# EAGLE design connector_board (EAGLE 9.4.2)

## Sheet 1 of 2
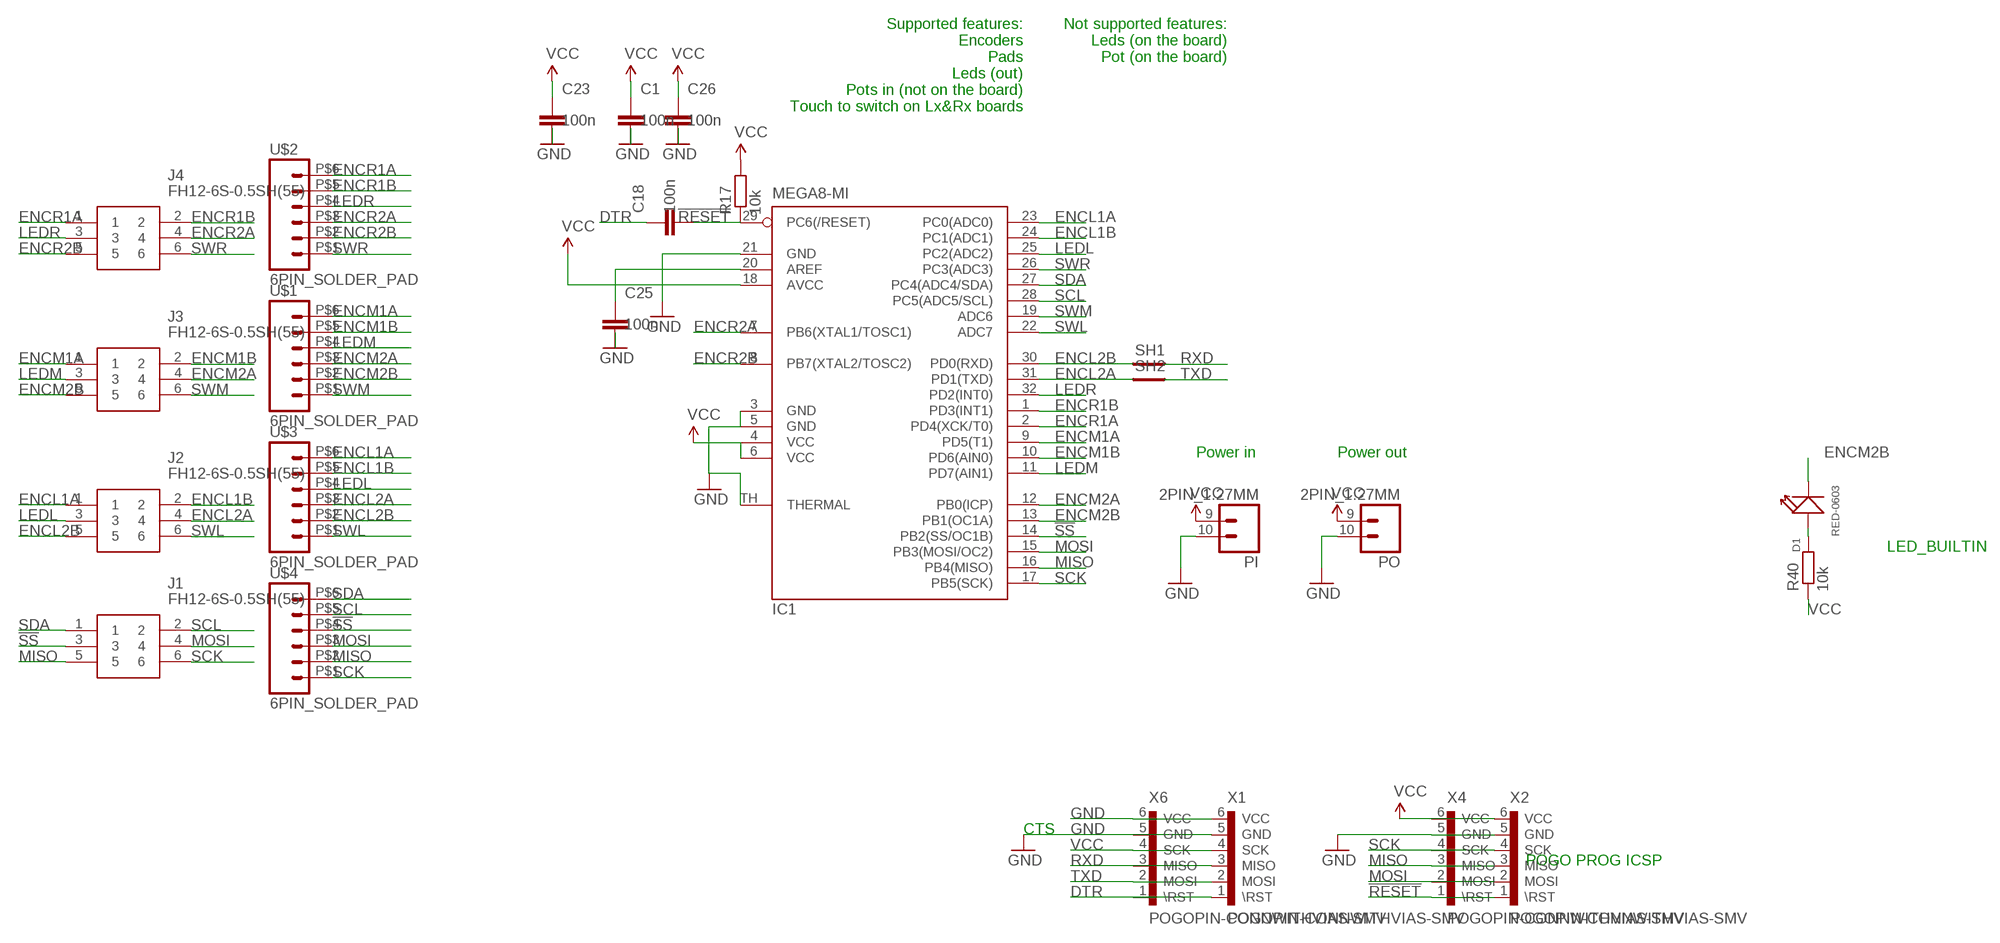
[diagram p0: schematic, sheet 1]

### Parts
C1  100n  C-EUC0603  [C0603]
C18  100n  C-EUC0603  [C0603]
C23  100n  C-EUC0603  [C0603]
C25  100n  C-EUC0603  [C0603]
C26  100n  C-EUC0603  [C0603]
D1  RED-0603  LED-SMD-RED-DIFFUSED(0603)  [LED-0603]
IC1  MEGA8-MI  [MLF32-TH]
J1  FH12-6S-0.5SH(55)  [FH12-6S-0.5SH(55)_1]
J2  FH12-6S-0.5SH(55)  [FH12-6S-0.5SH(55)_1]
J3  FH12-6S-0.5SH(55)  [FH12-6S-0.5SH(55)_1]
J4  FH12-6S-0.5SH(55)  [FH12-6S-0.5SH(55)_1]
PI  2PIN_1.27MM  [1X02_1.27MM_NO_SILK]
PO  2PIN_1.27MM  [1X02_1.27MM_NO_SILK]
R17  10k  R-EU_R0603  [R0603]
R40  10k  R-EU_R0603  [R0603]
SH1  SHORT  [SHORT_TOP_8MIL]
SH2  SHORT  [SHORT_TOP_8MIL]
U$1  6PIN_SOLDER_PAD  [6PIN_SOLDER_PAD]
U$2  6PIN_SOLDER_PAD  [6PIN_SOLDER_PAD]
U$3  6PIN_SOLDER_PAD  [6PIN_SOLDER_PAD]
U$4  6PIN_SOLDER_PAD  [6PIN_SOLDER_PAD]
X1  POGOPIN-CONNWITHVIAS-SMV  [POGOPROG-CONN-OH-SMALLERVIAS]
X2  POGOPIN-CONNWITHVIAS-SMV  [POGOPROG-CONN-OH-SMALLERVIAS]
X4  POGOPIN-CONNWITHVIAS-SMV  [POGOPROG-CONN-OH-SMALLERVIAS]
X6  POGOPIN-CONNWITHVIAS-SMV  [POGOPROG-CONN-OH-SMALLERVIAS]

### Nets
!RESET: C18.2 IC1.29(PC6(/RESET)) R17.1 X2.1(\RST) X4.1(\RST)
!SS: IC1.14(PB2(SS/OC1B)) J1.3 U$4.P$4
AREF: C25.1 IC1.20(AREF)
DTR: C18.1 X1.1(\RST) X6.1(\RST)
ENCL1A: IC1.23(PC0(ADC0)) J2.1 U$3.P$6
ENCL1B: IC1.24(PC1(ADC1)) J2.2 U$3.P$5
ENCL2A: IC1.31(PD1(TXD)) J2.4 SH2.P$1 U$3.P$3
ENCL2B: IC1.30(PD0(RXD)) J2.5 SH1.P$1 U$3.P$2
ENCM1A: IC1.9(PD5(T1)) J3.1 U$1.P$6
ENCM1B: IC1.10(PD6(AIN0)) J3.2 U$1.P$5
ENCM2A: IC1.12(PB0(ICP)) J3.4 U$1.P$3
ENCM2B: D1.- IC1.13(PB1(OC1A)) J3.5 U$1.P$2
ENCR1A: IC1.2(PD4(XCK/T0)) J4.1 U$2.P$6
ENCR1B: IC1.1(PD3(INT1)) J4.2 U$2.P$5
ENCR2A: IC1.7(PB6(XTAL1/TOSC1)) J4.4 U$2.P$3
ENCR2B: IC1.8(PB7(XTAL2/TOSC2)) J4.5 U$2.P$2
GND: C1.2 C23.2 C25.2 C26.2 IC1.3(GND) IC1.5(GND) IC1.21(GND) IC1.TH(THERMAL) PI.10 PO.10 X1.5(GND) X1.6(VCC) X2.5(GND) X4.5(GND) X6.5(GND) X6.6(VCC) ; also sheet 2
LEDL: IC1.25(PC2(ADC2)) J2.3 U$3.P$4
LEDM: IC1.11(PD7(AIN1)) J3.3 U$1.P$4
LEDR: IC1.32(PD2(INT0)) J4.3 U$2.P$4
MISO: IC1.16(PB4(MISO)) J1.5 U$4.P$2 X2.3(MISO) X4.3(MISO) ; also sheet 2
MOSI: IC1.15(PB3(MOSI/OC2)) J1.4 U$4.P$3 X2.2(MOSI) X4.2(MOSI) ; also sheet 2
N$1: D1.+ R40.2
RXD: SH1.P$2 X1.3(MISO) X6.3(MISO)
SCK: IC1.17(PB5(SCK)) J1.6 U$4.P$1 X2.4(SCK) X4.4(SCK) ; also sheet 2
SCL: IC1.28(PC5(ADC5/SCL)) J1.2 U$4.P$5
SDA: IC1.27(PC4(ADC4/SDA)) J1.1 U$4.P$6
SWL: IC1.22(ADC7) J2.6 U$3.P$1
SWM: IC1.19(ADC6) J3.6 U$1.P$1
SWR: IC1.26(PC3(ADC3)) J4.6 U$2.P$1
TXD: SH2.P$2 X1.2(MOSI) X6.2(MOSI)
VCC: C1.1 C23.1 C26.1 IC1.4(VCC) IC1.6(VCC) IC1.18(AVCC) PI.9 PO.9 R17.2 R40.1 X1.4(SCK) X2.6(VCC) X4.6(VCC) X6.4(SCK)

### Notes on the sheet
- Supported features:
  Encoders
  Pads
  Leds (out)
  Pots in (not on the board)
  Touch to switch on Lx&Rx boards
- Not supported features:
  Leds (on the board)
  Pot (on the board)
- Power in | Power out
- LED_BUILTIN
- CTS
- POGO PROG ICSP

## Sheet 2 of 2
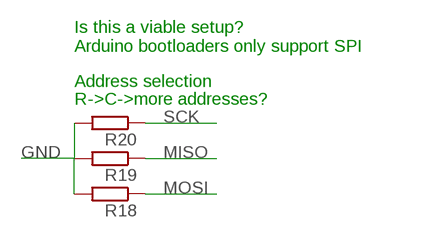
[diagram p1: schematic, sheet 2]

### Parts
R18  R-EU_R0603  [R0603]
R19  R-EU_R0603  [R0603]
R20  R-EU_R0603  [R0603]

### Nets
GND: R18.2 R19.2 R20.2 ; also sheet 1
MISO: R19.1 ; also sheet 1
MOSI: R18.1 ; also sheet 1
SCK: R20.1 ; also sheet 1

### Notes on the sheet
- Is this a viable setup?
  Arduino bootloaders only support SPI
- Address selection
- R->C->more addresses?

## Library data of the parts
C1 C18 C23 C25 C26 = rcl:C-EU: CAPACITOR, European symbol; SPICEPREFIX: C
D1 = Seeed-LED-2016:LED-SMD-RED-DIFFUSED(0603): 304090042; MPN: 19-217-R6C-AL1M2VY-3T
IC1 = atmel:MEGA8-MI: MICROCONTROLLER 8 Kbytes FLASH, 1 kbytes SRAM, 512 bytes EEPROM, USART, 6-channel 10 bit ADC, 2-channel 8 bit ADC Pin compatible with Atmega48, ATMega88, ATMega168 Source: avr.lbr; MPN: ATMEGA88PA-MU; OC_FARNELL: 1715491; OC_NEWARK: 15R0272
J1-J4 = FH12-6S-0.5SH(55):FH12-6S-0.5SH(55): HIROSE(HRS) - FH12-6S-0.5SH(55) - FFC/FPC CONNECTOR, RECEPTACLE, 6POS 1ROW Source: Datasheet <https://www.hirose.com/product/en/download_file/key_name/FH12-6S-0.5SH(55)/category/Drawing (2D)/doc_file_id/75611/?file_category_id=6&item_id=05860582555&is_series=>; DESCRIPTION: HIROSE(HRS) - FH12-6S-0.5SH(55) - FFC/FPC CONNECTOR, RECEPTACLE, 6POS 1ROW; HEIGHT: mm; MANUFACTURER_NAME: Hirose; MANUFACTURER_PART_NUMBER: FH12-6S-0.5SH(55); MOUSER_PART_NUMBER: 798-FH12-6S-0.5SH55; MOUSER_PRICE-STOCK: https://www.mouser.com/Search/Refine.aspx?Keyword=798-FH12-6S-0.5SH55; RS_PART_NUMBER: 7388811P; RS_PRICE-STOCK: http://uk.rs-online.com/web/p/products/7388811P
PI PO = edge:2PIN_1.27MM
R17-R20 R40 = rcl:R-EU_: RESISTOR, European symbol; SPICEPREFIX: R
SH1 SH2 = shorts:SHORT: Short between two nets
U$1-U$4 = edge:6PIN_SOLDER_PAD
X1 X2 X4 X6 = Protofusion:POGOPIN-CONN: Protofusion custom pogo pin programming header

## Board
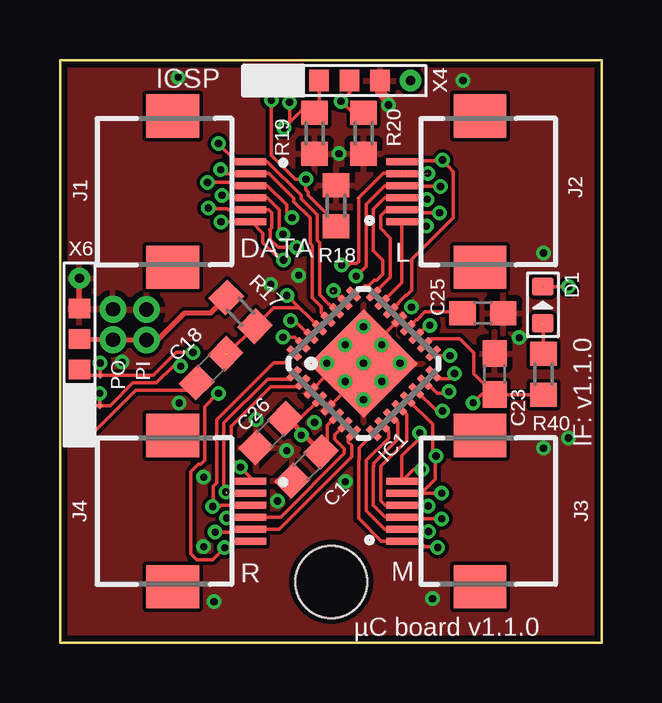
[diagram p2: board, top side]
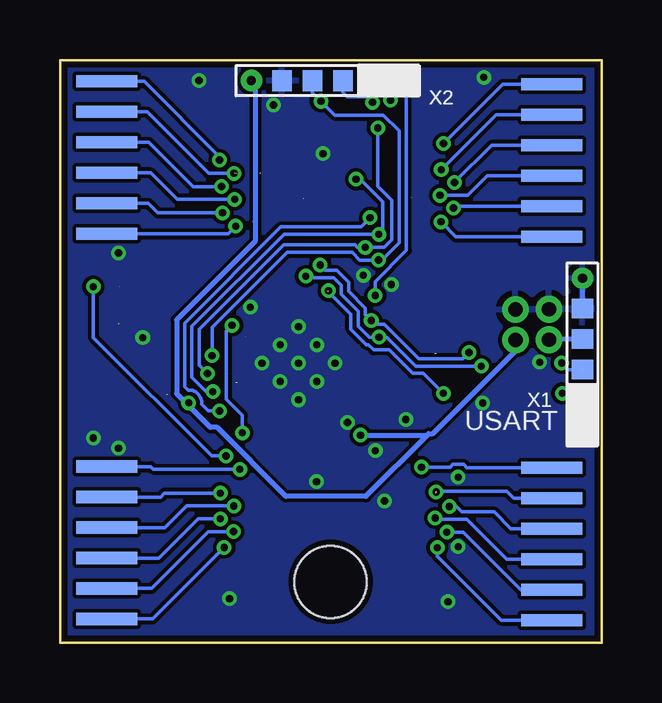
[diagram p3: board, bottom side, seen from below]

Size 22.58 x 24.28 mm. Coordinates in mm from the lower left corner, seen from the top.
Outline: 0,0 0,24.28 22.58,24.28 22.58,0 0,0
Copper layers (1*16): Top 0.035mm / dielectric 1.5mm / Bottom 0.035mm
Design rules "seeed-studio-2-layer *": minimum track width 6mil, minimum drill 0.3mm, track to track 6mil, track to pad 6mil, pad to pad 6mil, via to via 6mil, smd to smd 0mil, copper to edge 10mil, drill to drill 10mil, minimum pad ring 10mil, minimum via ring 6mil, stop-mask expansion 2mil, vias tented up to drill 100mil, thermal gap 10mil
Holes 3 mm at 11.3,2.54

### Footprints (pad centres in the part's own frame; a part is rotated, then mirrored left to right if it is on the bottom)
C0603 = smd 1.1 x 1: 1 -0.85,0; 2 0.85,0
LED-0603 = smd 0.762 x 0.889: + -0.762,0; - 0.762,0
MLF32-TH = smd 0.7 x 0.3: 1 -2.35,1.75; 2 -2.35,1.25; 3 -2.35,0.75; 4 -2.35,0.25; 5 -2.35,-0.25; 6 -2.35,-0.75; 7 -2.35,-1.25; 8 -2.35,-1.75; 17 2.35,-1.75; 18 2.35,-1.25; 19 2.35,-0.75; 20 2.35,-0.25; 21 2.35,0.25; 22 2.35,0.75; 23 2.35,1.25; 24 2.35,1.75 | smd 0.3 x 0.7: 9 -1.75,-2.35; 10 -1.25,-2.35; 11 -0.75,-2.35; 12 -0.25,-2.35; 13 0.25,-2.35; 14 0.75,-2.35; 15 1.25,-2.35; 16 1.75,-2.35; 25 1.75,2.35; 26 1.25,2.35; 27 0.75,2.35; 28 0.25,2.35; 29 -0.25,2.35; 30 -0.75,2.35; 31 -1.25,2.35; 32 -1.75,2.35 | smd 3.2 x 3.2: TH 0,0
FH12-6S-0.5SH(55)_1 = smd 0.3 x 1.3: 1 -1.25,0; 2 -0.75,0; 3 -0.25,0; 4 0.25,0; 5 0.75,0; 6 1.25,0 | smd 1.8 x 2.2: 7 -3.15,-3.25; 8 3.15,-3.25
1X02_1.27MM_NO_SILK = drill 0.6: 9 0,0; 10 1.27,0
R0603 = smd 1 x 1.1: 1 -0.85,0; 2 0.85,0
SHORT_TOP_8MIL = smd 0.203 x 0.203: P$1 0,0; P$2 0,0
6PIN_SOLDER_PAD = smd 0.508 x 2.54: P$1 0,0; P$2 1.27,0; P$3 2.54,0; P$4 3.81,0; P$5 5.08,0; P$6 6.35,0
POGOPROG-CONN-OH-SMALLERVIAS = drill 0.381: 1 0,2.54; 6 0,-3.81 | smd 0.889 x 0.813: 2 0,1.27; 3 0,0; 4 0,-1.27; 5 0,-2.54

### Placement (x,y rotation side)
C1  10.28,7.35 225 top
C18  6.3,11.44 45 top
C23  18.11,11.2 90 top
C25  17.62,13.73 0 top
C26  8.77,8.73 225 top
D1  20.12,14.08 90 top
IC1  12.65,11.64 45 top
J1  7.95,18.8 270 top
J2  14.25,18.8 90 top
J3  14.25,5.49 90 top
J4  7.95,5.49 270 top
PI  3.61,12.61 90 top
PO  2.21,12.63 90 top
R17  7.53,13.79 135 top
R18  11.5,18.21 90 top
R19  10.61,21.23 270 top
R20  12.65,21.23 270 top
R40  20.14,11.19 90 top
SH1  1.68,11.14 45 top
SH2  1.65,9.88 45 top
U$1  20.62,7.34 270 bottom
U$2  2.08,0.94 90 bottom
U$3  20.62,23.39 270 bottom
U$4  2.08,16.92 90 bottom
X1  0.81,11.38 180 bottom
X2  10.79,23.42 270 bottom
X4  10.8,23.43 90 top
X6  0.81,11.38 180 top

### Tracks (layer width: path | path; a pad name or v marks a point on that pad's centre or on a via)
!RESET  (via drill 0.3)  (3 unrouted)
  Top 0.152: IC1.29 10.38,13.55 9.97,13.96 | 9.97,13.96 9.46,14.47 v9.45,14.47 | 9.97,13.96 8.9,13.96 R17.1 6.98,12.04
  Bottom 0.152: X4.1 8.14,23.31 8.14,16.35 9.45,15.05 v9.45,14.47
!SS  (via drill 0.3)
  Top 0.152: IC1.14 15.69,9.66 v15.94,9.66 | v9.66,17.71 9.44,17.94 9.44,18.25 8.64,19.05 J1.3 7.27,19.05 7.13,19.18 v6.14,19.18
  Bottom 0.152: v15.94,9.66 16.25,9.66 16.4,9.66 16.68,9.93 arc-55 16.87,10.41 arc-45 17.16,10.53 17.25,10.53 17.39,10.67 17.39,13.31 13.38,17.32 10.02,17.32 9.66,17.68 v9.66,17.71 | U$4.P$4 4.6,20.73 v6.14,19.18
AREF
  Top 0.152: C25.1 16.72,13.79 15.21,13.79 14.88,13.46 14.83,13.46 IC1.20
DTR  (1 unrouted)
  Top 0.152: X1.1 1.47,8.84 3.15,10.52 5.38,10.52 C18.1 5.7,10.96
ENCL1A  (via drill 0.3)
  Top 0.152: IC1.23 14.25,15 J2.1 15.08,17.55 v15.26,17.36
  Bottom 0.152: U$3.P$6 15.58,17.04 v15.26,17.36
ENCL1B  (via drill 0.3)
  Top 0.152: IC1.24 13.77,15.22 13.77,16.87 13.37,17.26 13.37,17.8 13.62,18.05 J2.2 14.97,18.05 15.1,17.92 v15.81,17.92
  Bottom 0.152: U$3.P$5 18.9,18.31 18.5,17.92 v15.81,17.92
ENCL2A  (via drill 0.3)  (1 unrouted)
  Top 0.152: IC1.31 9.79,12.73 v9.29,12.73 | v5.03,11.53 4.71,11.53 4.01,10.83 3.04,10.83 2.08,9.88 SH2.P$1 | v12.34,15.27 12.75,15.69 12.75,18.26 13.53,19.05 J2.4 14.98,19.05 14.99,19.03 15.84,19.03 v15.85,19.01
  Bottom 0.152: U$3.P$3 18.88,20.85 17.04,19.01 v15.85,19.01 | v12.34,15.27 12.28,15.21 11.18,15.21 10.86,14.89 10.86,14.52 10.16,13.81 10.16,13.2 9.69,12.73 v9.29,12.73 8.97,12.73 7.76,11.53 v5.03,11.53 | v5.03,11.53
ENCL2B  (via drill 0.3)  (3 unrouted)
  Top 0.152: 12.43,18.53 13.46,19.56 14.24,19.56 | J2.5 15.2,19.55 | SH1.P$1 1.7,11.15 3.89,11.15 4.84,12.1 v5.54,12.1 | IC1.30 10.43,12.77 9.77,13.43 v9.61,13.43 | v11.74,15.74 12.06,15.74 12.12,15.8 12.37,15.8 12.45,15.88 12.45,18.52
  Bottom 0.152: U$3.P$2 18.95,22.12 16.38,19.56 v15.33,19.56 | v11.74,15.74 11.74,15.72 11.54,15.51 11.05,15.51 10.56,15.02 10.56,14.64 9.85,13.94 9.85,13.67 v9.61,13.43 9.45,13.26 9.07,13.26 7.64,11.83 5.79,11.83 5.79,11.84 v5.54,12.1
ENCM1A  (via drill 0.3)
  Top 0.152: v15.74,3.97 15.7,4.01 15.19,4.01 14.96,4.24 J3.1 13.39,4.24 12.45,5.18 12.45,7.61 12.46,7.62 12.46,8.12 IC1.9
  Bottom 0.152: U$1.P$6 18.72,0.99 v15.74,3.97
ENCM1B  (via drill 0.3)
  Top 0.152: 14.24,4.72 14.61,4.72 14.6,4.72 15.26,4.72 v15.35,4.63 | 14.24,4.72 13.54,4.72 12.75,5.51 12.75,7.48 12.76,7.5 12.76,7.61 13.69,8.53 13.69,8.82 IC1.10 | J3.2 14.24,4.72
  Bottom 0.152: U$1.P$5 18.77,2.26 16.39,4.63 v15.35,4.63
ENCM2A  (via drill 0.3)
  Top 0.152: v15.34,5.7 14.29,5.7 J3.4 13.54,5.74 13.37,5.91 13.37,7.21 13.37,7.22 13.37,7.35 14.44,8.42 14.44,9.51 14.16,9.8 IC1.12
  Bottom 0.152: U$1.P$3 18.21,4.8 17.31,5.7 v15.34,5.7
ENCM2B  (via drill 0.3)  (1 unrouted)
  Top 0.152: IC1.13 14.49,10.13 15.53,9.1 15.53,7.92 v15.66,7.78 15.63,7.75 15.63,6.82 15.05,6.24 J3.5 v15.9,6.24 v15.9,6.23 | D1.- v21.19,14.84
  Bottom 0.152: v21.19,14.84 21.19,12.71 16.27,7.78 v15.66,7.78 | U$1.P$2 18.39,6.07 18.23,6.23 v15.9,6.23
ENCR1A  (via drill 0.3)
  Top 0.152: IC1.2 9.91,10.66 8.77,10.66 7.14,9.03 7.14,7.7 v7.52,7.32 7.95,6.88 J4.1
  Bottom 0.152: v7.52,7.32 6.32,7.32 6.21,7.43 5.77,7.43 5.63,7.29 U$2.P$6
ENCR1B  (via drill 0.3)  (1 unrouted)
  Top 0.152: IC1.1 9.53,10.98 8.66,10.98 6.83,9.16 6.83,6.36 v6.91,6.29 | J4.2 6.95,6.24
  Bottom 0.152: U$2.P$5 3.66,6.02 3.96,6.31 6.88,6.31 v6.91,6.29
ENCR2A  (via drill 0.3)
  Top 0.152: IC1.7 11.46,8.67 11.46,8.48 11.85,8.09 11.85,7.89 9.19,5.24 J4.4 7.92,5.2 v6.95,5.2
  Bottom 0.152: v6.95,5.2 6.89,5.14 5.63,5.14 3.96,3.48 U$2.P$3
ENCR2B  (via drill 0.3)
  Top 0.152: IC1.8 12.01,8.52 12.01,8.36 12.15,8.22 12.15,7.75 9.14,4.74 J4.5 7.23,4.74 7.1,4.61 v6.47,4.61 v6.46,4.61
  Bottom 0.152: v6.46,4.61 5.78,4.61 3.38,2.21 U$2.P$2
GND  (via drill 0.3)
  Top 0.152: IC1.21 13.4,12.74 v13.4,12.41 | IC1.5 11.88,10.51 v11.88,10.89 | v11.12,11.65 11.12,11.16 IC1.3 10.26,10.3
  Top 0.203: X1.5 X1.6
  Top 0.406: X4.5 X2.5 13.34,22.94 13.69,22.6 v13.69,22.41
  Bottom 0.203: X1.6 X1.5
  other vias: 10.6,9.18 9.44,8 11.62,20.38 14.65,13.98 6.42,1.71 8.17,9.3 12.64,10.13 13.4,10.89 14.17,11.65 12.64,11.65 11.88,12.41 12.64,13.17 8.78,14.93 4.92,23.56 16.79,23.43 21.19,8.53 9.06,5.91 19.13,12.71 2.59,11.69 15.52,1.84 20.14,8.11 20.14,16.24 11.89,6.71 4.97,9.99 5.99,6.9 5.99,4 9.94,15.31
  pour Top: 0,0 0,24.28 22.58,24.28 22.58,0
  pour Bottom: 0,0 0,24.28 22.58,24.28 22.58,0
LEDL  (via drill 0.3)
  Top 0.152: IC1.25 12.36,14.53 12.69,14.87 12.87,14.87 13.1,15.1 13.2,15.1 13.45,15.35 13.45,15.93 13.06,16.33 13.06,18.07 13.54,18.55 J2.3 15.19,18.55 15.26,18.48 v15.3,18.48
  Bottom 0.152: U$3.P$4 18.8,19.58 17.69,18.48 v15.3,18.48
LEDM  (via drill 0.3)
  Top 0.152: 13.97,5.26 13.54,5.26 13.06,5.74 13.06,7.34 13.07,7.34 13.07,7.48 14.07,8.48 14.07,9.19 13.81,9.44 IC1.11 | 13.97,5.26 14.23,5.26 J3.3 | v15.9,5.17 14.06,5.17 13.97,5.26
  Bottom 0.152: U$1.P$4 18.46,3.53 16.83,5.17 v15.9,5.17
LEDR  (via drill 0.3)
  Top 0.152: IC1.32 9.36,11.67 8.9,11.67 6.53,9.29 6.53,6.67 6.38,6.52 6.38,5.7 v6.36,5.68 6.67,5.68 6.73,5.73 J4.3
  Bottom 0.152: v6.36,5.68 6.07,5.68 5.84,5.45 4.49,5.45 3.79,4.75 U$2.P$4
MISO  (via drill 0.3)  (1 unrouted)
  Top 0.152: v16.44,11.22 16.21,10.99 15.77,10.99 IC1.16 | R19.1 10.75,22.22 | 10.75,22.22 10.8,22.27 X4.3 | 10.61,21.79 R19.1 | 10.41,22.09 R19.1 | 10.75,22.22 10.11,22.22 v9.34,21.45 9.56,21.67 v9.56,22.52 | v6.18,18.11 6.21,18.08 6.98,18.08 7.01,18.05 J1.5 8.7,18.05 8.83,17.92 8.83,17.3 8.75,17.22 8.76,17.2 8.76,16.8 9.09,16.48 v9.86,16.48
  Bottom 0.152: X2.3 10.79,22.94 10.6,22.75 9.78,22.75 v9.56,22.53 v9.56,22.52 | v16.44,11.22 16.78,11.56 16.78,13.05 13.25,16.58 10.29,16.58 10.19,16.48 v9.86,16.48 v9.85,16.49 9.07,16.49 8.76,16.8 8.76,18.45 9.34,19.02 v9.34,21.45 | 6.16,18.19 6.11,18.19 | 6.11,18.19 U$4.P$2 | 6.11,18.19 v6.18,18.11
MOSI  (via drill 0.3)  (2 unrouted)
  Top 0.152: 15.26,10.86 15.72,10.39 16.14,10.39 v16.21,10.46 | X4.2 8.81,22.71 v8.81,22.61 8.81,20.31 9.8,19.32 v10.25,19.32 10.25,18.87 10.35,18.77 10.35,18.64 11.5,17.49 R18.1 | v9.29,17.02 9.13,17.18 9.13,18.05 8.64,18.54 J1.4 | J1.4 6.85,18.55 v6.75,18.65
  Bottom 0.152: v10.25,19.32 10.07,19.32 9.13,18.38 9.13,17.19 v9.29,17.02 13.24,17.02 17.08,13.18 17.08,11.05 16.49,10.46 v16.21,10.46 | X2.2 8.81,22.7 v8.81,22.61 | v6.75,18.65 5.59,18.65 4.78,19.46 U$4.P$3
N$1  (1 unrouted)
  Top 0.152: 20.14,13.29 R40.2
RXD  (via drill 0.3)  (1 unrouted)
  Top 0.152: X1.3 1.05,11.14 SH1.P$2 1.69,11.37 v1.69,11.65
  Bottom 0.152: v1.68,11.66 1.4,11.38 X1.3
SCK  (via drill 0.3)
  Top 0.152: R20.1 12.19,22.09 v11.71,22.56 12.07,22.92 X4.4 | IC1.17 15.65,11.96 v16.25,11.96 | v6.71,17.54 v6.71,17.55 J1.6 7.96,17.53 7.98,17.53 8.46,17.06 8.46,16.67 8.96,16.17 9.08,16.17 v9.31,15.95
  Bottom 0.152: v16.25,11.96 16.25,13.15 13.12,16.27 10.41,16.27 10.09,15.95 v9.31,15.95 9.17,15.95 8.45,16.67 8.45,21.33 9.1,21.98 11.13,21.98 v11.71,22.56 12.06,22.92 X2.4 | v6.71,17.54 6.08,16.92 U$4.P$1
SCL  (via drill 0.3)
  Top 0.152: v6.7,19.71 6.86,19.55 J1.2 7.96,19.56 8.7,19.56 9.74,18.51 9.74,18.39 10.42,17.71 10.42,16.64 10.52,16.54 10.52,14.37 10.89,13.99 10.89,13.75 IC1.28
  Bottom 0.152: v6.7,19.71 4.41,22 U$4.P$5
SDA  (via drill 0.3)
  Top 0.152: v6.6,20.8 7.36,20.05 J1.1 8.64,20.05 10.05,18.64 10.05,18.51 10.72,17.84 10.72,16.77 10.82,16.67 10.82,14.49 11.2,14.11 11.23,14.11 IC1.27
  Bottom 0.152: v6.6,20.8 4.14,23.27 U$4.P$6
SWL  (via drill 0.3)
  Top 0.152: J2.6 15.07,20.05 15.11,20.09 15.91,20.09 v15.94,20.12 16.38,19.63 16.38,17.71 14.65,15.97 14.65,14.69 14.45,14.49 14.4,14.49 14.09,14.18 14.09,14.14 IC1.22
  Bottom 0.152: U$3.P$1 19.08,23.39 15.94,20.25 v15.94,20.12
SWM  (via drill 0.3)  (1 unrouted)
  Top 0.152: IC1.19 15.3,13.23 v15.41,13.23 | v14.99,8.75 14.99,8.53 14.25,7.79 J3.6 14.74,7.23 v15.09,7.23
  Bottom 0.152: v15.41,13.23 15.66,12.97 15.66,10.15 14.99,9.47 v14.99,8.75 | 20.93,7.24 U$1.P$1 18.8,7.34 18.69,7.24 v15.1,7.24 v15.09,7.23
SWR  (via drill 0.3)  (2 unrouted)
  Top 0.152: IC1.26 v11.39,14.66 | v6.61,10.39 6.58,10.39 6.03,9.84 6.03,7.61 5.86,7.43 5.77,7.43 5.46,7.12 5.46,3.71 5.71,3.46 6.37,3.46 v6.86,3.96 6.99,3.96 7.26,4.24 J4.6
  Bottom 0.152: 11.39,14.62 10.46,13.68 10.46,13.07 9.82,12.43 9.73,12.43 9.51,12.2 8.87,12.2 7.89,11.22 7.44,11.22 v6.61,10.39 | v6.86,3.96 6.86,3.6 4.2,0.94 U$2.P$1
TXD  (via drill 0.3)  (1 unrouted)
  Top 0.152: X1.2 1.04,9.88 SH2.P$2 | v1.65,10.39 SH2.P$2
  Bottom 0.152: X1.2 1.1,10.39 v1.65,10.39
VCC  (via drill 0.3)  (2 unrouted)
  Top 0.152: IC1.6 11.14,9.07 11.14,8.22 C1.1 10.85,7.96 | C26.1 10,9.33 IC1.4 | v17.22,10 17.57,10.35 C23.1 17.24,11.22 17.24,12.08 16.65,12.68 15.46,12.68 IC1.18 | R40.1 C23.1
  Top 0.203: X1.4 2.18,12.65 PO.9 3.59,12.63 | 3.59,12.63 PI.9 | R17.2 6.26,13.73 5.18,13.73 4.08,12.63 3.59,12.63 | C1.1 10.18,8.65 | 10.18,8.65 v10.06,8.65 | C26.1 9.5,9.33 10.18,8.65
  Bottom 0.203: PI.9 3.61,12.15 7.04,8.71 7.22,8.71 7.29,8.65 | X4.6 14.46,23.27 14.46,17.55 14.46,16.73 17.72,13.46 17.72,10.39 17.27,9.93 17.24,9.93 | X1.4 2.18,12.65 PO.9 | v10.06,8.65 7.29,8.65 | 17.24,9.93 17.24,9.9 16.31,8.98 16.04,8.98 13.17,6.1 9.83,6.1 7.29,8.65 | v17.22,10 17.22,9.93 17.24,9.93

### Text on the board
tPlace: ICSP | DATA | L | IF: v1.1.0 | R | M | µC board v1.1.0
bPlace: USART
Document: the height of an SK6812 is 1.6mm where / as the height for a smd encoder is ~4.5mm | use WS2812B or SK6812 to save on gpio pins | GPIO needed: / I2C: 2 / SPI: 4 (+ interrupt?) / encoder: 2 / leds: 1 / = 5 - 7(/8) | (c> 2 1.9) | 0.5mm FFC max current = 0.55A / http://www.axon-cable.com/publications/FFC-Flat-Cables.pdf | F+M headerit päällekkäin on noin 5.1mm? | kooderin korkeus 4+(5-7 kierteet)mm
_tNames: X4 | R19 | R20 | J1 | J2 | X6 | R18 | D1 | R17 | C25 | PO | PI | C18 | C23 | C26 | IC1 | R40 | C1 | J3 | J4
_bNames: X2 | X1